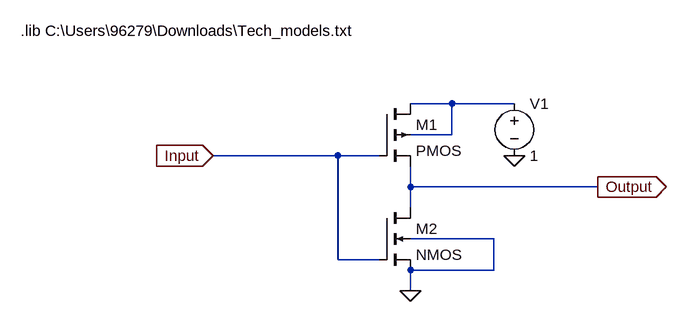
[diagram p0: schematic Invertor1.asc]
Invertor1.asc, the LTspice schematic file:
Version 4
SHEET 1 880 680
WIRE 416 176 352 176
WIRE 512 176 416 176
WIRE 416 224 416 176
WIRE 416 224 352 224
WIRE 240 256 48 256
WIRE 304 256 240 256
WIRE 352 304 352 272
WIRE 640 304 352 304
WIRE 352 336 352 304
WIRE 480 384 352 384
WIRE 240 416 240 256
WIRE 304 416 240 416
WIRE 480 432 480 384
WIRE 480 432 352 432
WIRE 352 464 352 432
FLAG 512 256 0
FLAG 352 464 0
FLAG 48 256 Input
IOPIN 48 256 In
FLAG 640 304 Output
IOPIN 640 304 Out
SYMBOL pmos4 304 176 R0
SYMATTR InstName M1
SYMATTR Value2 l=32n w=128n
SYMBOL nmos4 304 336 R0
SYMATTR InstName M2
SYMATTR Value2 l=32n w=64n
SYMBOL voltage 512 160 R0
SYMATTR InstName V1
SYMATTR Value 1
TEXT -248 64 Left 2 !.lib C:\\Users\\96279\\Downloads\\Tech_models.txt

The netlist it stands for:
* Invertor1.asc
M1 N001 Input Output N001 PMOS l=32n w=128n
M2 Output Input 0 0 NMOS l=32n w=64n
V1 N001 0 1
.model NMOS NMOS
.model PMOS PMOS
.lib standard.mos
.lib C:\Users\96279\Downloads\Tech_models.txt
.backanno
.end